# Altium schematic sheet ESP32 scematic.SchDoc
size A2; SheetNumber: 1; SheetTotal: 1
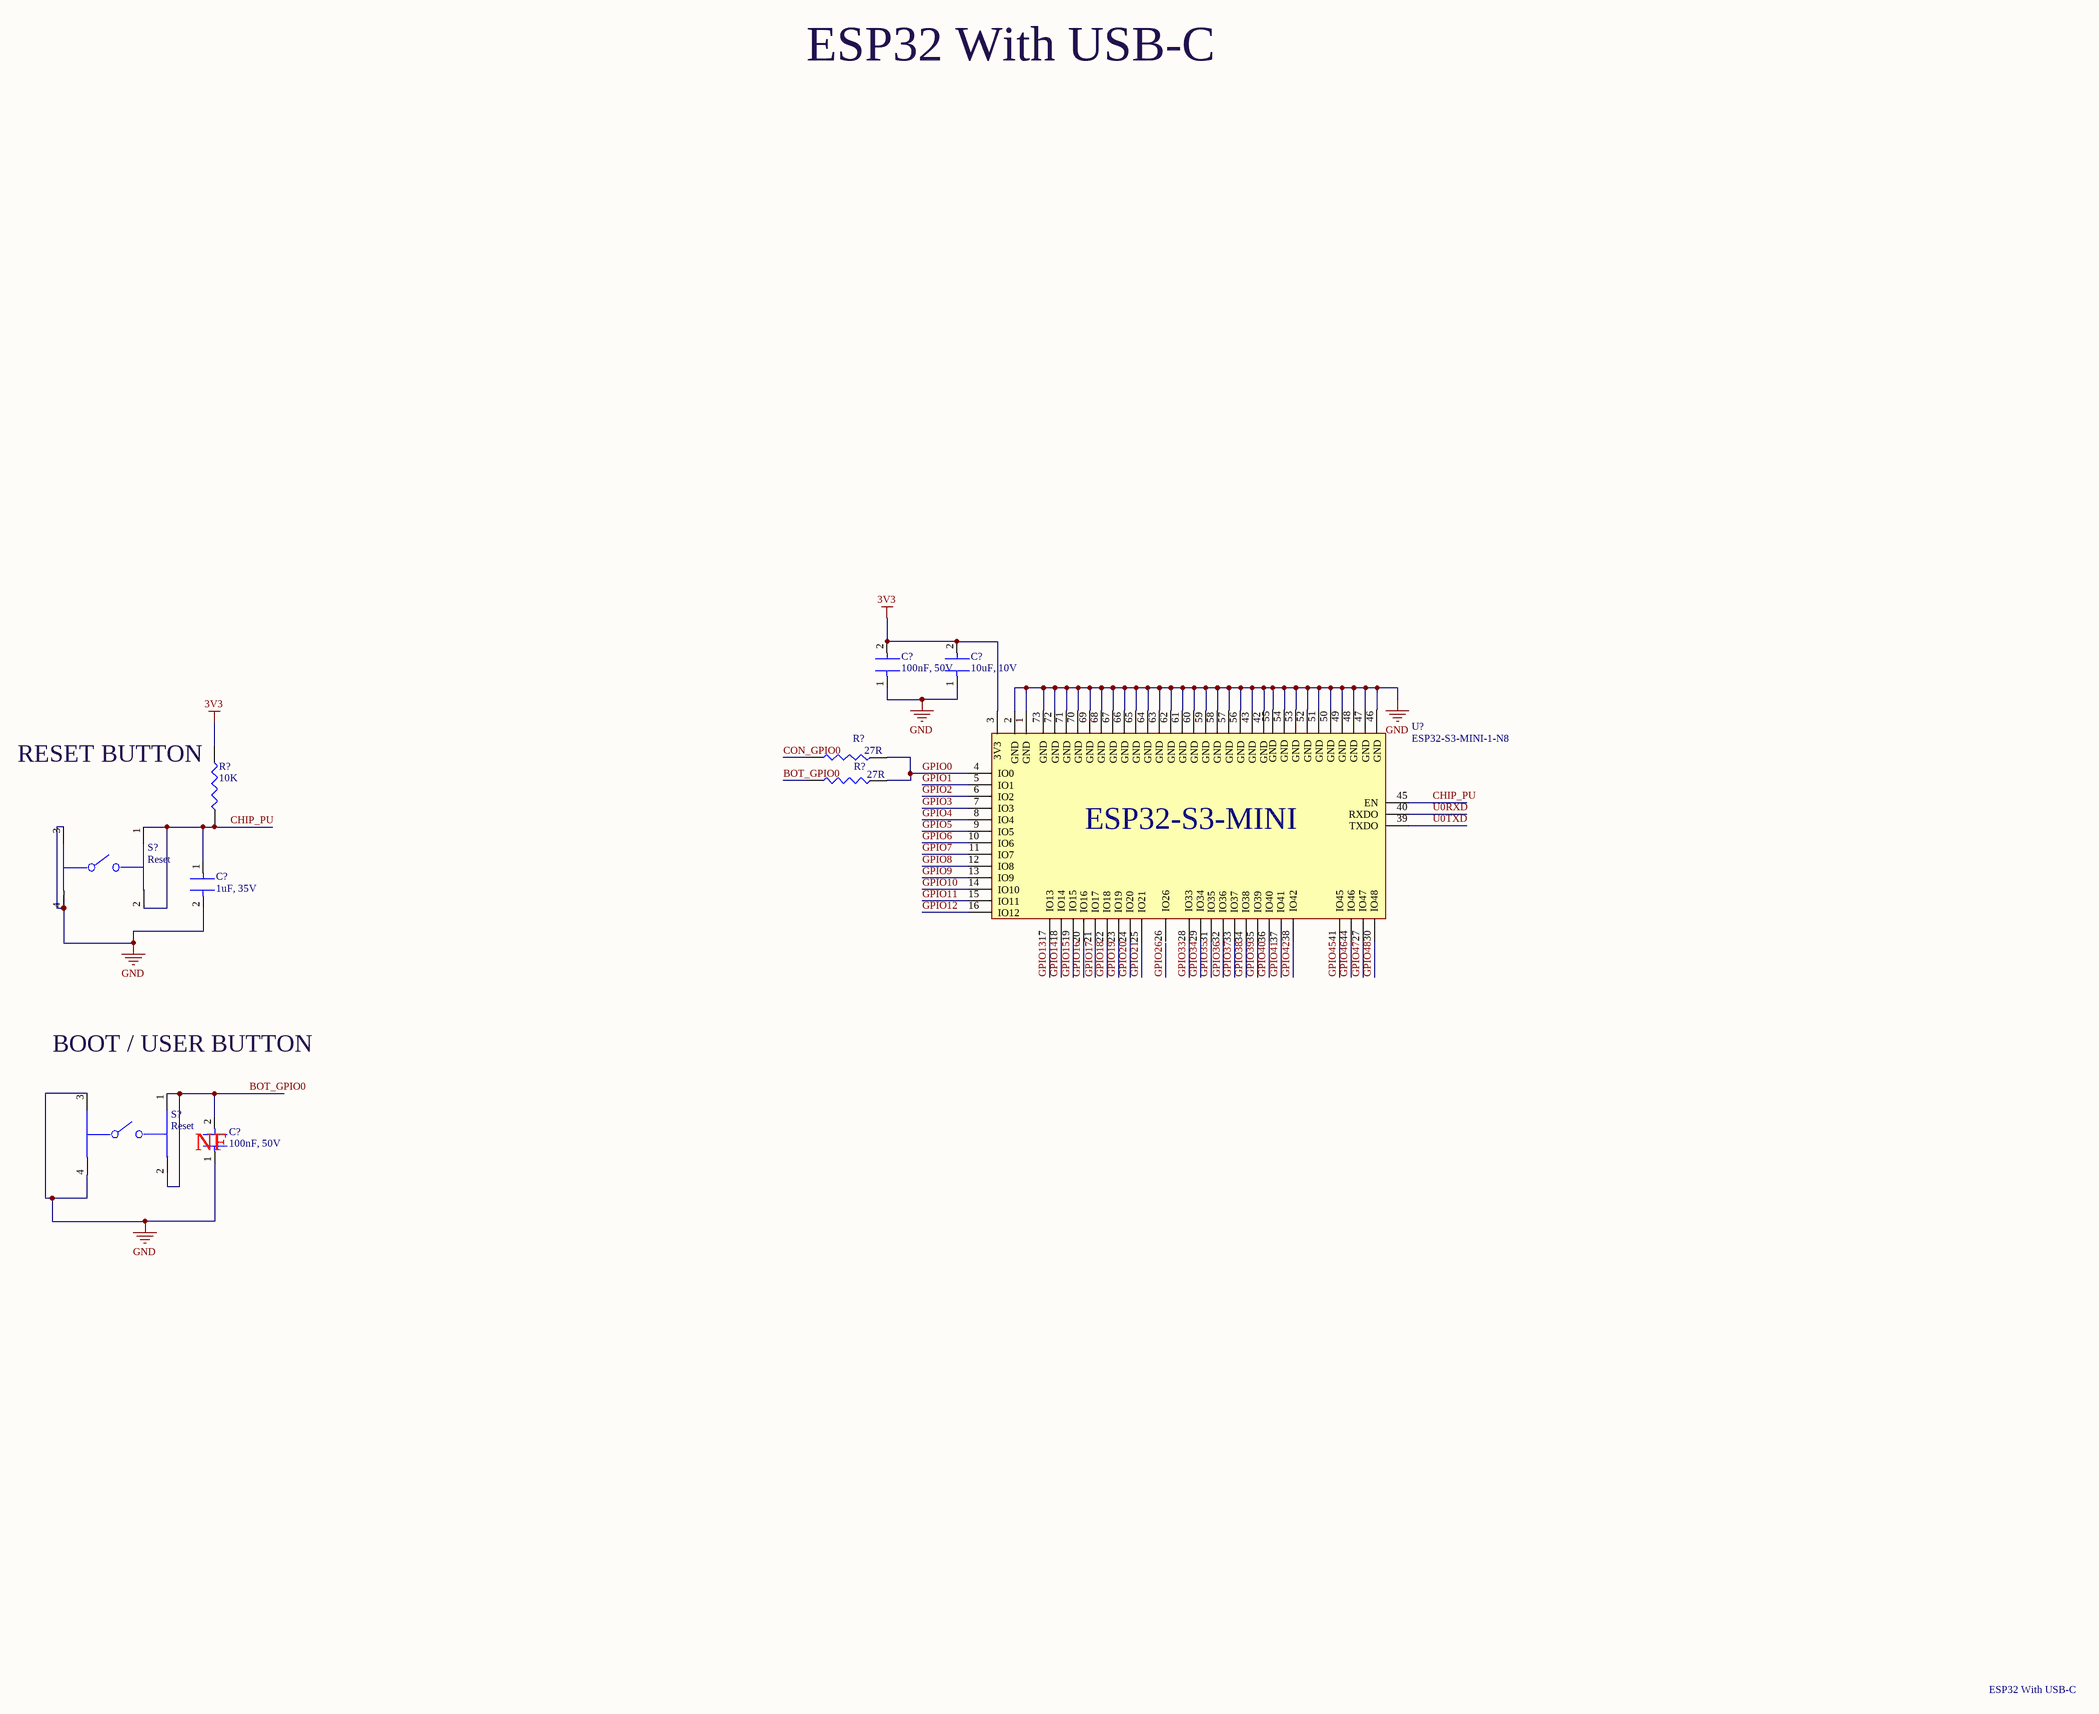
[diagram p0: ESP32 scematic.SchDoc]

## Parts
(Parts that share a designator on the sheet are numbered #1, #2 ... from top to bottom, then left to right.)
C?#1  100nF, 50V
C?#2  10uF, 10V
C?#3  1uF, 35V
C?#4  100nF, 50V
R?#1  27R
R?#2  10K
R?#3  27R
S?#1  Reset
S?#2  Reset
U?  ESP32-S3-MINI-1-N8

## Nets
3V3: C?#1.2 C?#2.2 R?#2.2 U?.3(3V3)
GND: C?#1.1 C?#2.1 C?#3.2 C?#4.1 S?#1.3 S?#1.4 S?#2.3 S?#2.4 U?.1(GND) U?.2(GND) U?.42(GND) U?.43(GND) U?.46(GND) U?.47(GND) U?.48(GND) U?.49(GND) U?.50(GND) U?.51(GND) U?.52(GND) U?.53(GND) U?.54(GND) U?.55(GND) U?.56(GND) U?.57(GND) U?.58(GND) U?.59(GND) U?.60(GND) U?.61(GND) U?.62(GND) U?.63(GND) U?.64(GND) U?.65(GND) U?.66(GND) U?.67(GND) U?.68(GND) U?.69(GND) U?.70(GND) U?.71(GND) U?.72(GND) U?.73(GND)
BOT_GPIO0: C?#4.2 R?#3.1 S?#2.1 S?#2.2
CHIP_PU: C?#3.1 R?#2.1 S?#1.1 S?#1.2 U?.45(EN)
CON_GPIO0: R?#1.1
GPIO0: R?#1.2 R?#3.2 U?.4(IO0)
GPIO1: U?.5(IO1)
GPIO2: U?.6(IO2)
GPIO3: U?.7(IO3)
GPIO4: U?.8(IO4)
GPIO5: U?.9(IO5)
GPIO6: U?.10(IO6)
GPIO7: U?.11(IO7)
GPIO8: U?.12(IO8)
GPIO9: U?.13(IO9)
GPIO10: U?.14(IO10)
GPIO11: U?.15(IO11)
GPIO12: U?.16(IO12)
GPIO13: U?.17(IO13)
GPIO14: U?.18(IO14)
GPIO15: U?.19(IO15)
GPIO16: U?.20(IO16)
GPIO18: U?.22(IO18)
GPIO19: U?.23(IO19)
GPIO20: U?.24(IO20)
GPIO21: U?.25(IO21)
GPIO33: U?.28(IO33)
GPIO34: U?.29(IO34)
GPIO35: U?.31(IO35)
GPIO37: U?.33(IO37)
GPIO38: U?.34(IO38)
GPIO39: U?.35(IO39)
GPIO40: U?.36(IO40)
GPIO41: U?.37(IO41)
GPIO42: U?.38(IO42)
GPIO45: U?.41(IO45)
GPIO46: U?.44(IO46)
GPIO47: U?.27(IO47)
GPIO48: U?.30(IO48)
U0RXD: U?.40(RXDO)
U0TXD: U?.39(TXDO)

Not connected (* = marked no-connect by the designer): U? 21(IO17) 26(IO26) 32(IO36)

## Notes on the sheet
- ESP32 With USB-C
- RESET BUTTON
- BOOT / USER BUTTON
- (near C?#4) NF
- Labels drawn without touching a wire or pin: GPIO17, GPIO36
- (in symbol ESP32-S3-MINI-1-N8) ESP32-S3-MINI

## Library data of the parts
C?#1 C?#4 = capacitor 0.1uf: 50V 100nF X7R ±10% 0402 Multilayer Ceramic Capacitors MLCC - SMD/SMT ROHS; Manfacture  part number: CL05B104KB54PNC; Manfacturer: Samsung Electro-Mechanics; Supplier: LCSC; Supplier part number: C307331; stock: 2024
C?#2 = capactior 10uf: 10V 10uF X5R ±20% 0402 Multilayer Ceramic Capacitors MLCC - SMD/SMT ROHS; Supllier part number: C307415; Manfacture  part number: CL05A106MP8NUB8; Supllier: LCSC; Manfacturer: Samsung Electro-Mechanics; stock: 2024
C?#3 = capacitor 1uF: 35V 1uF X5R ±10% 0402 Multilayer Ceramic Capacitors MLCC - SMD/SMT ROHS; Manfacture part number: CL05A105KL5NRNC; Manfacturer: Samsung Electro-Mechanics; Supplier: LCSC; Supplier part number: C307413; stock: 2024
R?#1 R?#3 = Resistor 27: 62.5mW Thick Film Resistors 50V ±100ppm/℃ ±1% 27Ω 0402 Chip Resistor - Surface Mount ROHS; Manufacturer: YAGEO; Manufacturer part number: RC0402FR-0727RL; Supplier: LCSC; Supplier part number: C138021; stock: 2024
R?#2 = Resistor 10k: 62.5mW Thick Film Resistors 50V ±100ppm/℃ ±1% 10kΩ 0402 Chip Resistor - Surface Mount ROHS; Manfacturer part number: AC0402FR-0710KL; Manfacturer: YAGEO; Supplier: LCSC; Supplier part number: C144807; stock: 2024
S?#1 S?#2 = switch: Round Button 50mA Standing paste SPST - normally open 160gf 12V SMD,6x6mm Tactile Switches ROHS; Manfacturer part number: PTS645SM43JSMTR92 LFS; Manfacturer: C&K; Supplier: LCSC; Supplier part number: C2801847; stock: 2024
U? = ESP32-S3-MINI-1-N8: SMD Module ESP32; Manfacturer: Espressif Systems; Supplier: LCSC; Supplier part number: C2913206; Manfacture part number: ESP32-S3-MINI-1-N8; Stock: 2024